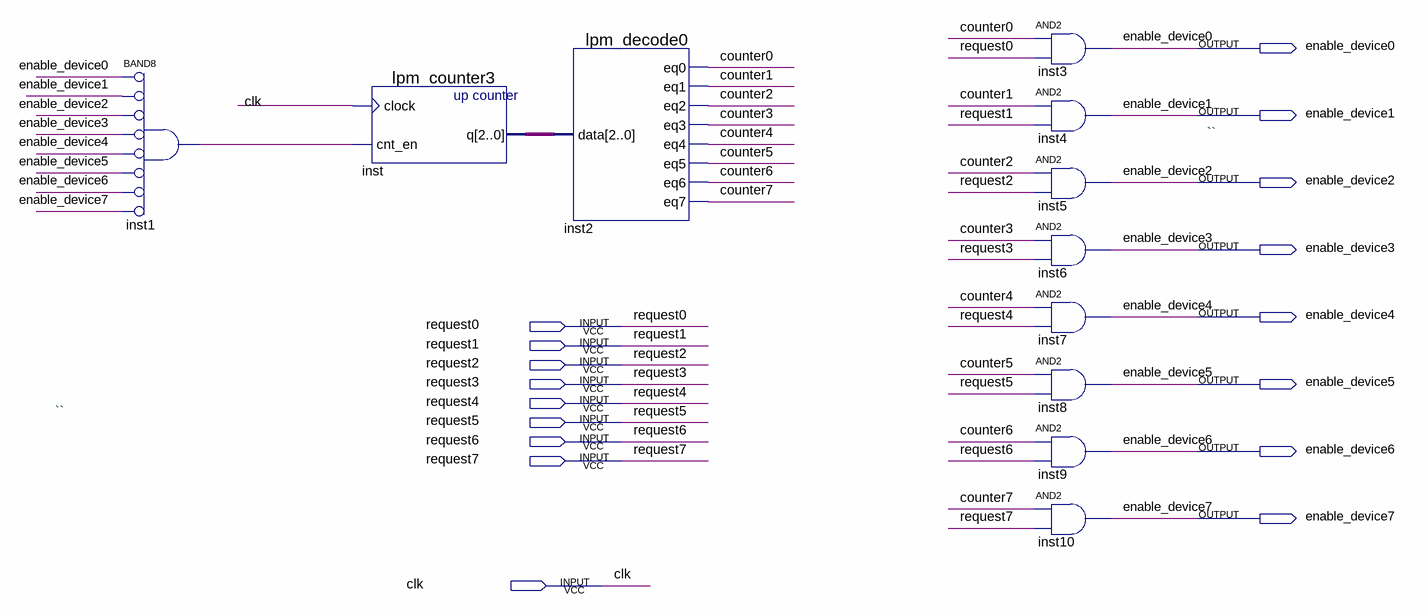
[diagram p0: schematic sheet]
// Quartus schematic Control.bdf as structural Verilog: 11 symbols, 17 pins
module Control (
  input  request0,
  input  request1,
  input  request2,
  input  request3,
  input  request4,
  input  request5,
  input  request6,
  input  request7,
  input  clk,
  output enable_device0,
  output enable_device1,
  output enable_device2,
  output enable_device3,
  output enable_device4,
  output enable_device5,
  output enable_device6,
  output enable_device7
);

  wire counter0, counter1, counter2, counter3, counter4, counter5, counter6, counter7, inst1_out;
  wire [2:0] inst_q;

  and inst1 (inst1_out, ~enable_device0, ~enable_device1, ~enable_device2, ~enable_device3, ~enable_device4, ~enable_device5, ~enable_device6, ~enable_device7);  // BAND8
  lpm_counter3 inst (.clock(clk), .cnt_en(inst1_out), .q(inst_q));
  lpm_decode0 inst2 (
    .data(inst_q), .eq0(counter0), .eq1(counter1), .eq2(counter2), .eq3(counter3), .eq4(counter4),
    .eq5(counter5), .eq6(counter6), .eq7(counter7));
  and inst3 (enable_device0, counter0, request0);
  and inst4 (enable_device1, counter1, request1);
  and inst5 (enable_device2, counter2, request2);
  and inst6 (enable_device3, counter3, request3);
  and inst7 (enable_device4, counter4, request4);
  and inst8 (enable_device5, counter5, request5);
  and inst9 (enable_device6, counter6, request6);
  and inst10 (enable_device7, counter7, request7);

  // Notes on the sheet:
  //   ``
  //   ``
endmodule
